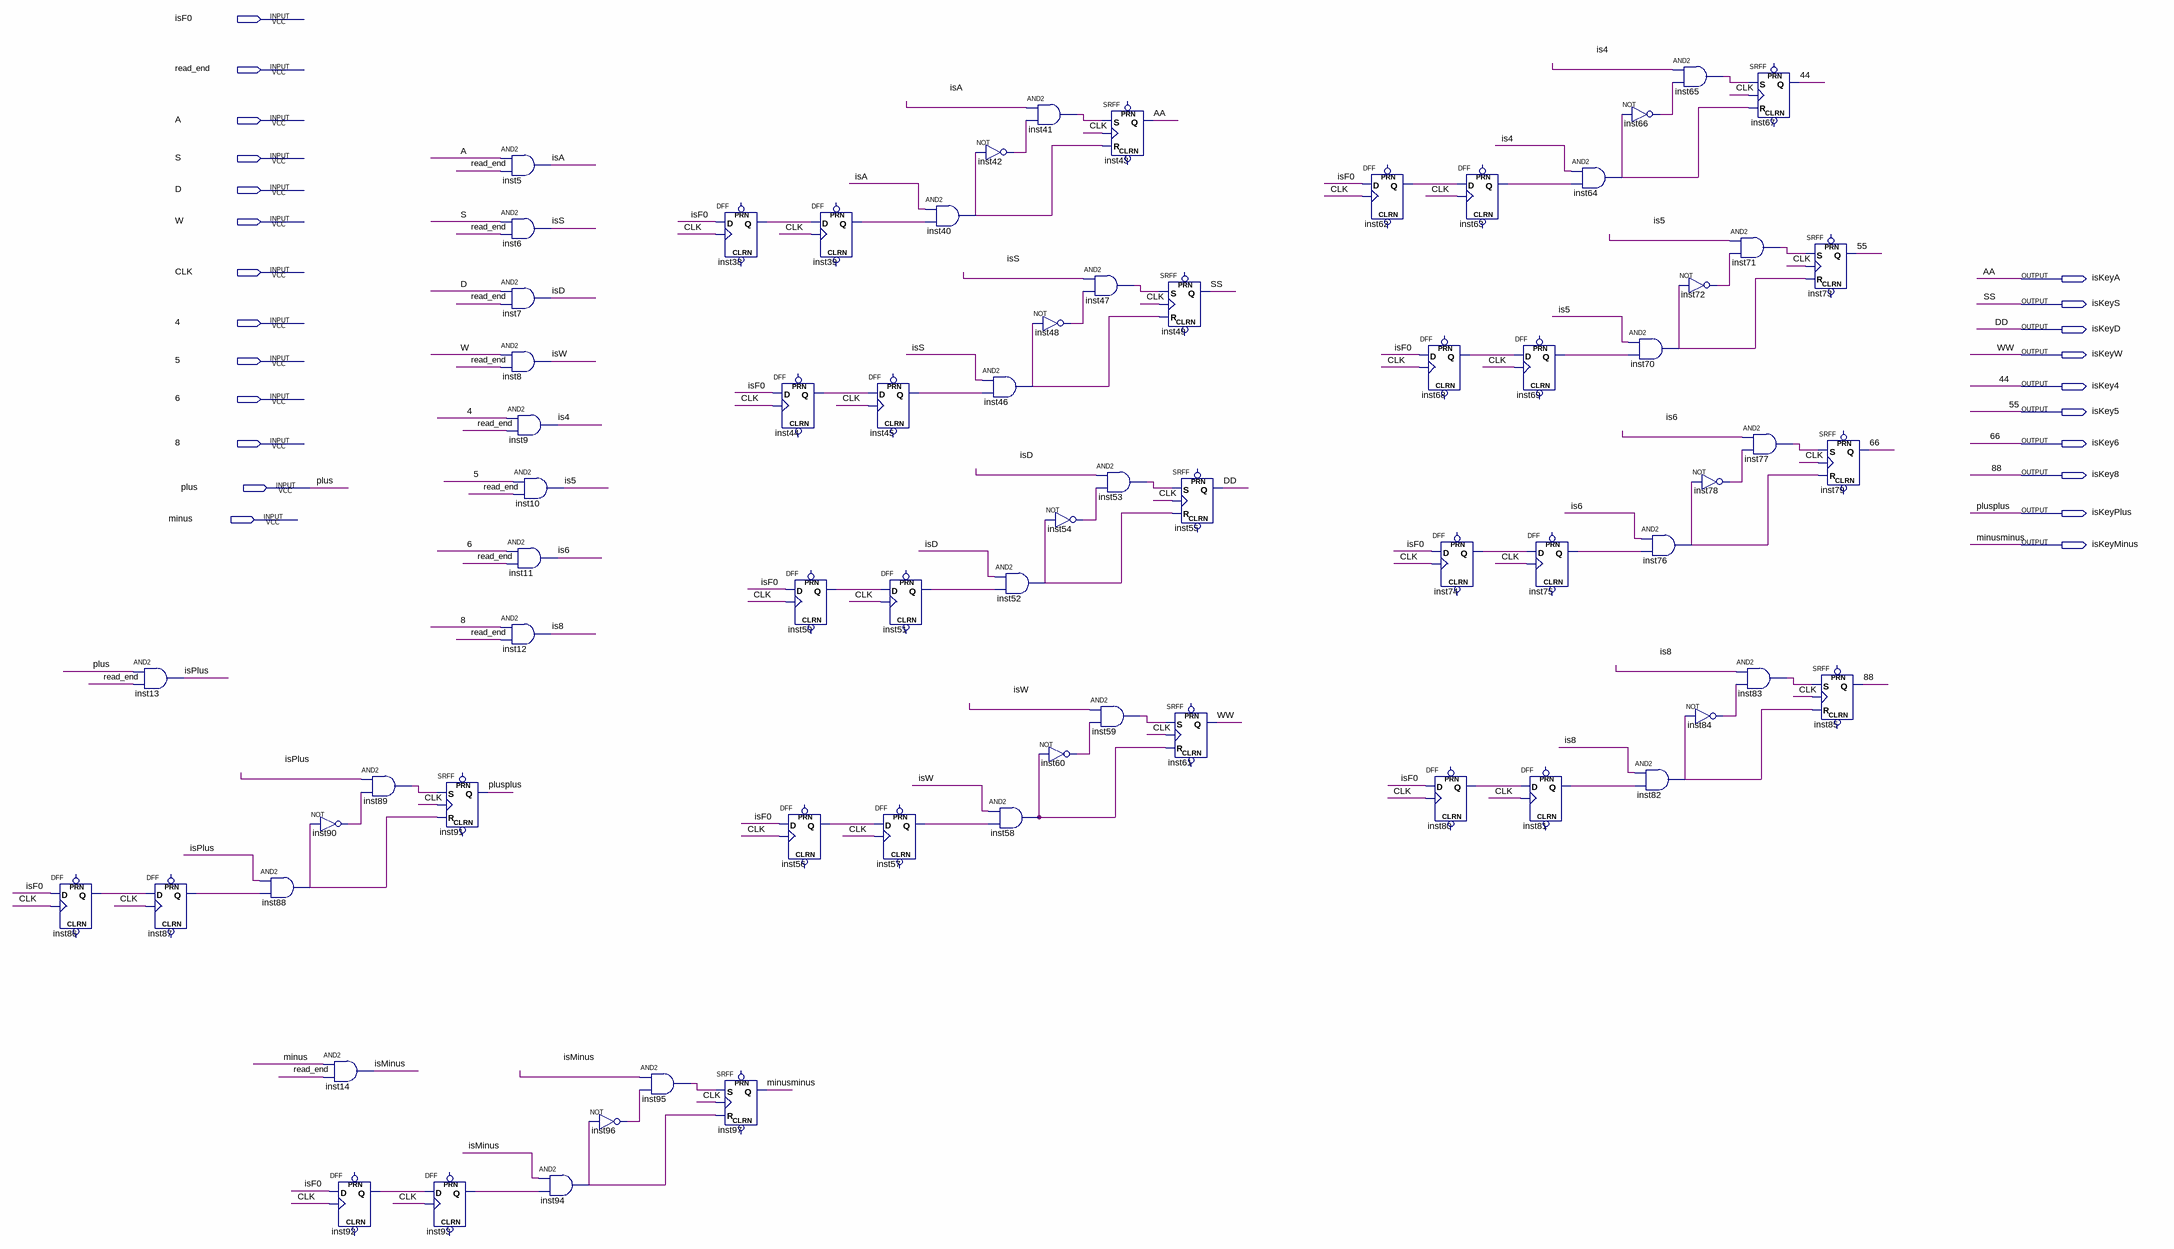
[diagram p0: schematic sheet]
// Quartus schematic keyHoldDetect.bdf as structural Verilog: 70 symbols, 23 pins
module keyHoldDetect (
  input  isF0,
  input  read_end,
  input  A,
  input  S,
  input  D,
  input  W,
  input  CLK,
  input  \4 ,
  input  \5 ,
  input  \6 ,
  input  \8 ,
  input  plus,
  input  minus,
  output isKeyA,
  output isKeyS,
  output isKeyD,
  output isKeyW,
  output isKey4,
  output isKey5,
  output isKey6,
  output isKey8,
  output isKeyPlus,
  output isKeyMinus
);

  wire inst38_q, inst39_q, inst40_out, inst41_out, inst42_out, inst44_q, inst45_q, inst46_out, inst47_out,
       inst48_out, inst50_q, inst51_q, inst52_out, inst53_out, inst54_out, inst56_q, inst57_q, inst58_out,
       inst59_out, inst60_out, inst62_q, inst63_q, inst64_out, inst65_out, inst66_out, inst68_q, inst69_q,
       inst70_out, inst71_out, inst72_out, inst74_q, inst75_q, inst76_out, inst77_out, inst78_out, inst80_q,
       inst81_q, inst82_out, inst83_out, inst84_out, inst86_q, inst87_q, inst88_out, inst89_out, inst90_out,
       inst92_q, inst93_q, inst94_out, inst95_out, inst96_out, is4, is5, is6, is8, isA, isD, isMinus, isPlus,
       isS, isW;

  DFF inst86 (.CLK(CLK), .D(isF0), .Q(inst86_q));  // open: CLRN, PRN
  and inst13 (isPlus, plus, read_end);
  DFF inst87 (.CLK(CLK), .D(inst86_q), .Q(inst87_q));  // open: CLRN, PRN
  and inst88 (inst88_out, isPlus, inst87_q);
  not inst90 (inst90_out, inst88_out);
  and inst14 (isMinus, minus, read_end);
  DFF inst92 (.CLK(CLK), .D(isF0), .Q(inst92_q));  // open: CLRN, PRN
  and inst89 (inst89_out, isPlus, inst90_out);
  SRFF inst91 (.S(inst89_out), .R(inst88_out), .CLK(CLK), .Q(isKeyPlus));  // open: PRN, CLRN
  DFF inst93 (.CLK(CLK), .D(inst92_q), .Q(inst93_q));  // open: CLRN, PRN
  and inst5 (isA, A, read_end);
  and inst6 (isS, S, read_end);
  and inst7 (isD, D, read_end);
  and inst8 (isW, W, read_end);
  and inst12 (is8, \8 , read_end);
  and inst9 (is4, \4 , read_end);
  and inst10 (is5, \5 , read_end);
  and inst11 (is6, \6 , read_end);
  and inst94 (inst94_out, isMinus, inst93_q);
  not inst96 (inst96_out, inst94_out);
  and inst95 (inst95_out, isMinus, inst96_out);
  DFF inst38 (.CLK(CLK), .D(isF0), .Q(inst38_q));  // open: CLRN, PRN
  SRFF inst97 (.S(inst95_out), .R(inst94_out), .CLK(CLK), .Q(isKeyMinus));  // open: PRN, CLRN
  DFF inst44 (.CLK(CLK), .D(isF0), .Q(inst44_q));  // open: CLRN, PRN
  DFF inst50 (.CLK(CLK), .D(isF0), .Q(inst50_q));  // open: CLRN, PRN
  DFF inst56 (.CLK(CLK), .D(isF0), .Q(inst56_q));  // open: CLRN, PRN
  DFF inst39 (.CLK(CLK), .D(inst38_q), .Q(inst39_q));  // open: CLRN, PRN
  DFF inst45 (.CLK(CLK), .D(inst44_q), .Q(inst45_q));  // open: CLRN, PRN
  DFF inst51 (.CLK(CLK), .D(inst50_q), .Q(inst51_q));  // open: CLRN, PRN
  DFF inst57 (.CLK(CLK), .D(inst56_q), .Q(inst57_q));  // open: CLRN, PRN
  and inst40 (inst40_out, isA, inst39_q);
  not inst42 (inst42_out, inst40_out);
  and inst46 (inst46_out, isS, inst45_q);
  and inst52 (inst52_out, isD, inst51_q);
  and inst58 (inst58_out, isW, inst57_q);
  and inst41 (inst41_out, isA, inst42_out);
  not inst48 (inst48_out, inst46_out);
  not inst54 (inst54_out, inst52_out);
  not inst60 (inst60_out, inst58_out);
  SRFF inst43 (.S(inst41_out), .R(inst40_out), .CLK(CLK), .Q(isKeyA));  // open: PRN, CLRN
  and inst47 (inst47_out, isS, inst48_out);
  and inst53 (inst53_out, isD, inst54_out);
  and inst59 (inst59_out, isW, inst60_out);
  SRFF inst49 (.S(inst47_out), .R(inst46_out), .CLK(CLK), .Q(isKeyS));  // open: PRN, CLRN
  SRFF inst55 (.S(inst53_out), .R(inst52_out), .CLK(CLK), .Q(isKeyD));  // open: PRN, CLRN
  SRFF inst61 (.S(inst59_out), .R(inst58_out), .CLK(CLK), .Q(isKeyW));  // open: PRN, CLRN
  DFF inst62 (.CLK(CLK), .D(isF0), .Q(inst62_q));  // open: CLRN, PRN
  DFF inst63 (.CLK(CLK), .D(inst62_q), .Q(inst63_q));  // open: CLRN, PRN
  DFF inst68 (.CLK(CLK), .D(isF0), .Q(inst68_q));  // open: CLRN, PRN
  DFF inst74 (.CLK(CLK), .D(isF0), .Q(inst74_q));  // open: CLRN, PRN
  DFF inst80 (.CLK(CLK), .D(isF0), .Q(inst80_q));  // open: CLRN, PRN
  DFF inst69 (.CLK(CLK), .D(inst68_q), .Q(inst69_q));  // open: CLRN, PRN
  DFF inst75 (.CLK(CLK), .D(inst74_q), .Q(inst75_q));  // open: CLRN, PRN
  DFF inst81 (.CLK(CLK), .D(inst80_q), .Q(inst81_q));  // open: CLRN, PRN
  and inst64 (inst64_out, is4, inst63_q);
  not inst66 (inst66_out, inst64_out);
  and inst70 (inst70_out, is5, inst69_q);
  and inst76 (inst76_out, is6, inst75_q);
  and inst82 (inst82_out, is8, inst81_q);
  and inst65 (inst65_out, is4, inst66_out);
  not inst72 (inst72_out, inst70_out);
  not inst78 (inst78_out, inst76_out);
  not inst84 (inst84_out, inst82_out);
  SRFF inst67 (.S(inst65_out), .R(inst64_out), .CLK(CLK), .Q(isKey4));  // open: PRN, CLRN
  and inst71 (inst71_out, is5, inst72_out);
  and inst77 (inst77_out, is6, inst78_out);
  and inst83 (inst83_out, is8, inst84_out);
  SRFF inst73 (.S(inst71_out), .R(inst70_out), .CLK(CLK), .Q(isKey5));  // open: PRN, CLRN
  SRFF inst79 (.S(inst77_out), .R(inst76_out), .CLK(CLK), .Q(isKey6));  // open: PRN, CLRN
  SRFF inst85 (.S(inst83_out), .R(inst82_out), .CLK(CLK), .Q(isKey8));  // open: PRN, CLRN

  // Other names for the same wires on the sheet: 44 = isKey4; 55 = isKey5; 66 = isKey6; 88 = isKey8; AA = isKeyA;
  //   DD = isKeyD; minusminus = isKeyMinus; plusplus = isKeyPlus; SS = isKeyS; WW = isKeyW
endmodule
